# EAGLE schematic BREAKOUT_SOC8 (EAGLE 9.5.2)
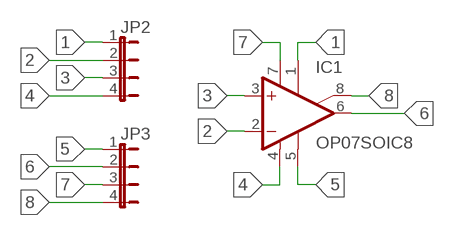
[diagram p0: schematic, sheet 1]

## Parts
IC1  OP07SOIC8  [SOIC8]
JP2  JP4E  [JP4]
JP3  JP4E  [JP4]

## Nets
1: IC1.1(ON1) JP2.1
2: IC1.2(-IN) JP2.2
3: IC1.3(+IN) JP2.3
4: IC1.4(V-) JP2.4
5: IC1.5(OPT) JP3.1
6: IC1.6(OUT) JP3.2
7: IC1.7(V+) JP3.3
8: IC1.8(ON2) JP3.4

## Library data of the parts
IC1 = OP07_JULIO:OP07*: OP AMP
JP2 JP3 = jumper-4:JP4E: JUMPER